# EAGLE design alpaca (EAGLE 9.6.2)
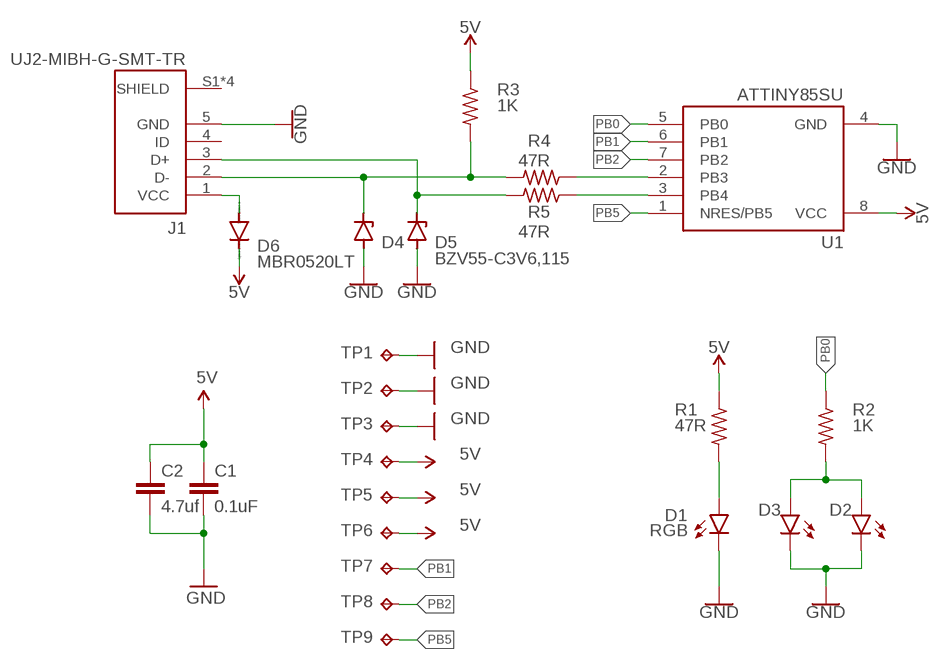
[diagram p0: schematic, sheet 1]

## Parts
C1  0.1uF  C-EUC0805K  [C0805K]
C2  4.7uf  C-EUC0805K  [C0805K]
D1  RGB  LED-3MM-NO_SILK  [LED_3MM-NS]
D2  LEDCHIPLED_1206  [CHIPLED_1206]
D3  LEDCHIPLED_1206  [CHIPLED_1206]
D4  BZV55-C3V6,115  ZENER-DIODESOD80C  [SOD80C]
D5  BZV55-C3V6,115  ZENER-DIODESOD80C  [SOD80C]
D6  MBR0520LT  [SOD123]
J1  UJ2-MIBH-G-SMT-TR  [CUI_UJ2-MIBH-G-SMT-TR]
R1  47R  R-US_R0603  [R0603]
R2  1K  R-US_R0603  [R0603]
R3  1K  R-US_R0603  [R0603]
R4  47R  R-US_R0603  [R0603]
R5  47R  R-US_R0603  [R0603]
TP1  TPTP13R  [TP13R]
TP2  TPTP13R  [TP13R]
TP3  TPTP13R  [TP13R]
TP4  TPTP13R  [TP13R]
TP5  TPTP13R  [TP13R]
TP6  TPTP13R  [TP13R]
TP7  TPTP13R  [TP13R]
TP8  TPTP13R  [TP13R]
TP9  TPTP13R  [TP13R]
U1  ATTINY85SU  [ATTINY85]

## Nets
5V: C1.1 C2.1 D6.C R1.1 R3.1 TP4.TP TP5.TP TP6.TP U1.8(VCC)
GND: C1.2 C2.2 D1.K(C) D2.C D3.C D4.A D5.A J1.5(GND) TP1.TP TP2.TP TP3.TP U1.4(GND)
N$1: D1.A R1.2
N$2: D4.C J1.2(D-) R3.2 R4.2
N$3: D5.C J1.3(D+) R5.2
N$5: D6.A J1.1(VCC)
N$6: R5.1 U1.3(PB4)
N$8: R4.1 U1.2(PB3)
N$9: D2.A D3.A R2.2
PB0: R2.1 U1.5(PB0)
PB1: TP7.TP U1.6(PB1)
PB2: TP8.TP U1.7(PB2)
PB5: TP9.TP U1.1(NRES/PB5)
Unconnected: J1.4(ID) J1.S1(SHIELD) J1.S2(SHIELD) J1.S3(SHIELD) J1.S4(SHIELD)

## Library data of the parts
C1 C2 = rcl:C-EU: CAPACITOR, European symbol; SPICEPREFIX: C
D1 = SparkFun-LED:LED: LED (Generic) Standard schematic elements and footprints for 5mm, 3mm, 1206, and 0603 sized LEDs. Generic LEDs with no color specified.
D2 D3 = led:LED: LED OSRAM: - CHIPLED LG R971, LG N971, LY N971, LG Q971, LY Q971, LO R971, LY R971 LH N974, LH R974 LS Q976, LO Q976, LY Q976 LO Q996 - Hyper CHIPLED LW Q18S LB Q993, LB Q99A, LB R99A - SideLED LS A670, LO A670, LY A670, LG A670, LP A670 LB A673, LV A673, LT A673, LW A673 LH A674 LY A675 LS A676, LA A676, LO A676, LY A676, LW A676 LS A679, LY A679, LG A679 - Hyper Micro SIDELED® LS Y876, LA Y876, LO Y876, LY Y876 LT Y87S - SmartLED LW L88C, LW L88S LB L89C, LB L89S, LG L890 LS L89K, LO L89K, LY L89K LS L896, LA L896, LO L896, LY L896 - TOPLED LS T670, LO T670, LY T670, LG T670, LP T670 LSG T670, LSP T670, LSY T670, LOP T670, LYG T670 LG T671, LOG T671, LSG T671 LB T673, LV T673, LT T673, LW T673 LH T674 LS T676, LA T676, LO T676, LY T676, LB T676, LH T676, LSB T676, LW T676 LB T67C, LV T67C, LT T67C, LS T67K, LO T67K, LY T67K, LW E67C LS E67B, LA E67B, LO E67B, LY E67B, LB E67C, LV E67C, LT E67C LW T67C LS T679, LY T679, LG T679 LS T770, LO T770, LY T770, LG T770, LP T770 LB T773, LV T773, LT T773, LW T773 LH T774 LS E675, LA E675, LY E675, LS T675 LS T776, LA T776, LO T776, LY T776, LB T776 LHGB T686 LT T68C, LB T68C - Hyper Mini TOPLED® LB M676 - Mini TOPLED Santana® LG M470 LS M47K, LO M47K, LY M47K Source: http://www.osram.convergy.de LUXEON: - LUMILED® LXK2-PW12-R00, LXK2-PW12-S00, LXK2-PW14-U00, LXK2-PW14-V00 LXK2-PM12-R00, LXK2-PM12-S00, LXK2-PM14-U00 LXK2-PE12-Q00, LXK2-PE12-R00, LXK2-PE12-S00, LXK2-PE14-T00, LXK2-PE14-U00 LXK2-PB12-K00, LXK2-PB12-L00, LXK2-PB12-M00, LXK2-PB14-N00, LXK2-PB14-P00, LXK2-PB14-Q00 LXK2-PR12-L00, LXK2-PR12-M00, LXK2-PR14-Q00, LXK2-PR14-R00 LXK2-PD12-Q00, LXK2-PD12-R00, LXK2-PD12-S00 LXK2-PH12-R00, LXK2-PH12-S00 LXK2-PL12-P00, LXK2-PL12-Q00, LXK2-PL12-R00 Source: www.luxeon.com KINGBRIGHT: KA-3528ASYC Source: www.kingbright.com
D4 D5 = diode:ZENER-DIODE: Z-Diode
D6 = diode:MBR0520LT: SCHOTTKY BARRIER RECTIFIER Source: http://onsemi.com .. MBR0520LT1-D.pdf
J1 = UJ2-MIBH-G-SMT-TR:UJ2-MIBH-G-SMT-TR: USB micro B type receptacle; MANUFACTURER: CUI; MAXIMUM_PACKAGE_HEIGHT: 2.95 mm; PARTREV: 1.0; STANDARD: Manufacturer Recommendations
R1-R5 = rcl:R-US_: RESISTOR, American symbol; SPICEPREFIX: R
TP1-TP9 = testpad:TP: Test pad
U1 = attiny85:ATTINY85: ATMEL ATtiny 85

## Board
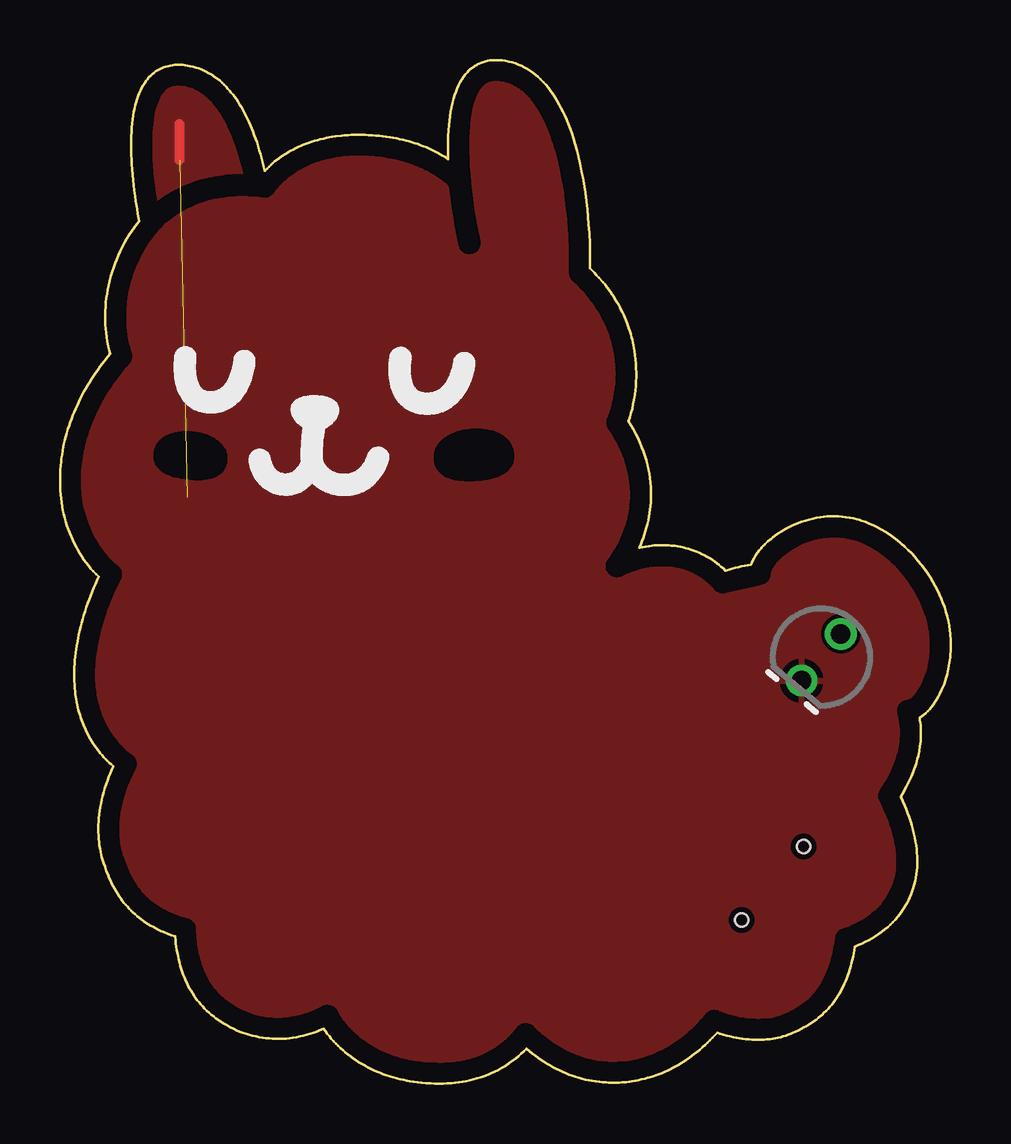
[diagram p1: board, top side]
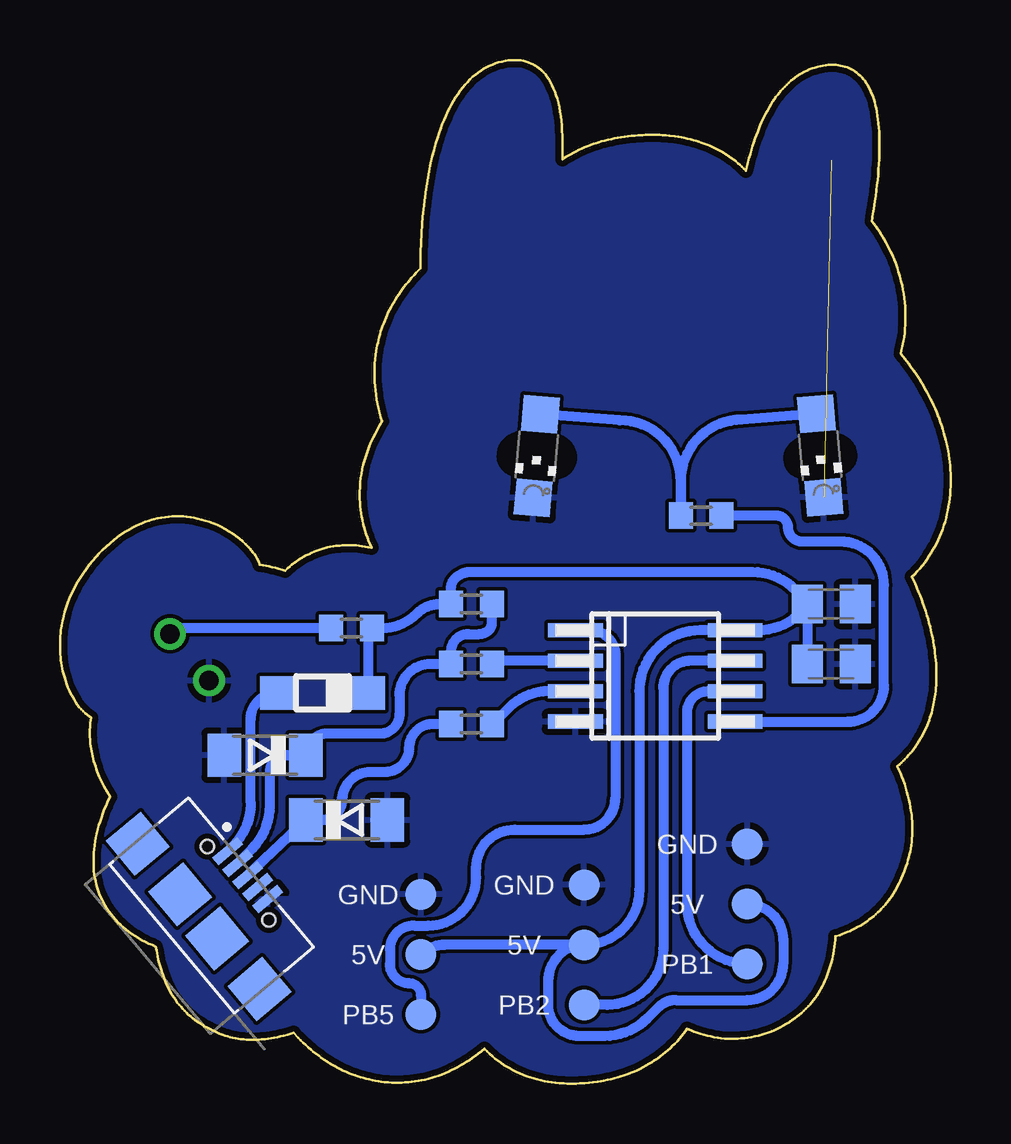
[diagram p2: board, bottom side, seen from below]

Size 37.14 x 42.65 mm. Coordinates in mm from the lower left corner, seen from the top.
Outline: 18.18,42.65 18.06,42.65 17.94,42.63 17.82,42.61 17.75,42.6 17.69,42.58 17.63,42.56 17.57,42.54 17.47,42.5 17.41,42.47 17.36,42.44 17.31,42.41 17.26,42.38 17.16,42.31 17.08,42.24 17.03,42.19 16.98,42.15 16.9,42.06 16.83,41.96 16.75,41.85 16.68,41.73 16.62,41.6 16.55,41.46 16.5,41.33 16.45,41.19 16.4,41.03 16.36,40.86 16.32,40.68 16.29,40.5 16.26,40.31 16.23,40.13 16.21,39.93 16.2,39.73 16.19,39.47 16.18,39.26 16.18,39 16.18,38.79 16.19,38.53 16.05,38.61 15.95,38.67 15.84,38.73 15.73,38.79 15.61,38.85 15.5,38.91 15.4,38.95 15.28,39.01 15.15,39.06 15.03,39.1 14.9,39.15 14.78,39.19 14.67,39.23 14.55,39.26 14.44,39.29 14.3,39.33 14.15,39.36 14.03,39.39 13.89,39.41 13.76,39.43 13.6,39.46 13.45,39.48 13.31,39.49 13.18,39.5 13.01,39.52 12.86,39.53 12.72,39.53 12.58,39.53 12.43,39.54 12.3,39.53 12.15,39.53 12.01,39.52 11.87,39.51 11.73,39.5 11.49,39.47 11.35,39.45 11.22,39.42 11.12,39.41 10.98,39.38 10.84,39.34 10.74,39.31 10.62,39.28 10.49,39.24 10.39,39.21 10.26,39.16 10.14,39.11 10.05,39.08 9.95,39.03 9.83,38.98 9.71,38.92 9.62,38.87 9.5,38.8 9.42,38.75 9.3,38.68 9.22,38.62 9.14,38.57 9.05,38.49 8.96,38.42 8.87,38.35 8.79,38.28 8.71,38.2 8.63,38.12 8.54,38.03 8.54,38.03 8.5,38.21 8.45,38.39 8.41,38.56 8.36,38.73 8.31,38.9 8.26,39.06 8.21,39.22 8.16,39.37 8.1,39.53 8.05,39.66 7.95,39.91 7.89,40.05 7.83,40.18 7.77,40.31 7.7,40.43 7.63,40.56 7.57,40.68 7.5,40.79 7.43,40.9 7.36,41.01 7.28,41.11 7.21,41.21 7.15,41.29 7.08,41.37 7,41.46 6.92,41.54 6.84,41.63 6.75,41.71 6.67,41.78 6.59,41.85 6.5,41.92 6.39,41.99 6.3,42.05 6.21,42.1 6.1,42.16 6,42.21 5.89,42.26 5.77,42.3 5.67,42.33 5.54,42.37 5.43,42.4 5.32,42.42 5.21,42.43 5.11,42.45 5,42.45 4.9,42.45 4.79,42.45 4.69,42.44 4.6,42.42 4.5,42.4 4.41,42.37 4.32,42.34 4.24,42.31 4.15,42.27 4.07,42.22 3.99,42.17 3.92,42.12 3.85,42.06 3.77,41.99 3.71,41.92 3.65,41.86 3.59,41.78 3.53,41.69 3.47,41.6 3.41,41.49 3.35,41.38 3.31,41.27 3.26,41.15 3.22,41.03 3.18,40.9 3.14,40.76 3.11,40.63 3.08,40.49 3.05,40.32 3.03,40.17 3.01,40.02 3,39.83 2.98,39.66 2.98,39.48 2.97,39.27 2.97,39.11 2.97,38.9 2.98,38.69 2.98,38.52 3,38.3 3.01,38.09 3.03,37.87 3.05,37.65 3.07,37.43 3.1,37.21 3.13,36.98 3.16,36.77 3.21,36.46 3.24,36.25 3.3,35.94 3.19,35.81 3.09,35.67 2.99,35.52 2.89,35.37 2.79,35.21 2.7,35.05 2.6,34.85 2.52,34.69 2.43,34.49 2.36,34.34 2.3,34.18 2.23,33.99 2.18,33.83 2.12,33.65 2.07,33.46 2.03,33.27 1.99,33.09 1.96,32.91 1.94,32.73 1.92,32.56 1.9,32.36 1.89,32.18 1.89,32 1.89,31.81 1.89,31.63 1.91,31.45 1.92,31.28 1.95,31.1 1.97,30.93 2.01,30.73 2.05,30.56 2.09,30.41 2.09,30.4 1.98,30.28 1.86,30.13 1.76,30 1.68,29.89 1.57,29.73 1.48,29.62 1.4,29.49 1.32,29.37 1.23,29.22 1.15,29.09 1.07,28.96 1,28.82 0.91,28.67 0.85,28.54 0.77,28.39 0.71,28.25 0.65,28.11 0.59,27.98 0.54,27.84 0.48,27.7 0.43,27.56 0.38,27.41 0.33,27.26 0.28,27.11 0.24,26.95 0.2,26.8 0.17,26.64 0.14,26.53 0.11,26.37 0.08,26.2 0.06,26.04 0.05,25.92 0.03,25.75 0.01,25.58 0.01,25.4 0,25.24 0,25.08 0,24.91 0.01,24.71 0.03,24.55 0.05,24.37 0.06,24.22 0.09,24.03 0.12,23.89 0.16,23.72 0.19,23.58 0.24,23.42 0.29,23.26 0.34,23.1 0.4,22.95 0.46,22.81 0.52,22.66 0.59,22.53 0.67,22.37 0.74,22.24 0.83,22.1 0.91,21.96 1,21.83 1.09,21.71 1.19,21.58 1.29,21.46 1.39,21.35 1.5,21.23 1.61,21.11 1.56,20.99 1.48,20.82 1.41,20.67 1.34,20.5 1.27,20.32 1.22,20.17 1.16,20.02 1.1,19.85 1.05,19.69 1,19.51 0.94,19.34 0.91,19.21 0.86,19.03 0.83,18.9 0.79,18.71 0.76,18.57 0.73,18.43 0.7,18.24 0.68,18.1 0.66,17.96 0.64,17.78 0.62,17.64 0.61,17.5 0.6,17.36 0.6,17.21 0.6,17.06 0.6,16.92 0.6,16.78 0.61,16.63 0.62,16.48 0.63,16.34 0.65,16.22 0.68,16.01 0.7,15.9 0.72,15.78 0.74,15.68 0.77,15.57 0.8,15.46 0.83,15.35 0.87,15.25 0.9,15.14 0.94,15.03 0.98,14.93 1.07,14.74 1.12,14.64 1.17,14.54 1.22,14.44 1.27,14.36 1.33,14.27 1.39,14.17 1.51,14 1.63,13.84 1.69,13.77 1.76,13.68 1.82,13.61 1.91,13.52 1.97,13.46 2.06,13.37 2.13,13.3 2.22,13.22 2.23,13.21 2.16,13.08 2.09,12.92 2.04,12.79 1.98,12.64 1.93,12.48 1.87,12.32 1.82,12.15 1.78,12 1.74,11.84 1.71,11.68 1.68,11.52 1.66,11.38 1.63,11.21 1.62,11.06 1.61,10.92 1.6,10.78 1.6,10.63 1.6,10.48 1.61,10.36 1.62,10.21 1.63,10.06 1.65,9.94 1.67,9.79 1.69,9.66 1.72,9.55 1.75,9.43 1.78,9.31 1.82,9.19 1.88,9.03 1.94,8.86 2,8.7 2.06,8.56 2.11,8.45 2.16,8.33 2.22,8.23 2.28,8.12 2.34,8.01 2.4,7.91 2.46,7.82 2.53,7.72 2.6,7.63 2.66,7.54 2.73,7.46 2.82,7.36 2.89,7.28 2.96,7.21 3.04,7.13 3.13,7.05 3.22,6.98 3.3,6.91 3.39,6.84 3.48,6.77 3.57,6.71 3.68,6.65 3.77,6.59 3.88,6.53 3.98,6.47 4.1,6.41 4.21,6.36 4.3,6.32 4.5,6.24 4.63,6.19 4.8,6.13 4.81,6.13 4.82,5.99 4.83,5.84 4.85,5.71 4.87,5.57 4.9,5.42 4.92,5.3 4.95,5.18 4.98,5.04 5.01,4.92 5.05,4.79 5.09,4.66 5.14,4.53 5.19,4.41 5.24,4.29 5.29,4.17 5.35,4.07 5.41,3.95 5.46,3.86 5.52,3.76 5.58,3.66 5.64,3.58 5.72,3.48 5.79,3.39 5.86,3.31 5.94,3.23 6.04,3.12 6.12,3.04 6.21,2.96 6.31,2.88 6.4,2.8 6.5,2.73 6.6,2.66 6.74,2.56 6.85,2.5 6.96,2.43 7.09,2.36 7.23,2.29 7.35,2.23 7.5,2.17 7.62,2.12 7.76,2.08 7.89,2.04 8.03,2 8.17,1.97 8.31,1.94 8.45,1.91 8.6,1.89 8.72,1.88 8.87,1.87 9,1.87 9.14,1.87 9.28,1.87 9.42,1.88 9.57,1.89 9.71,1.91 9.86,1.94 10,1.97 10.14,2 10.28,2.03 10.43,2.08 10.56,2.12 10.7,2.17 10.82,2.22 10.99,2.29 11,2.29 11.07,2.19 11.14,2.09 11.23,1.98 11.31,1.88 11.4,1.78 11.5,1.67 11.6,1.57 11.69,1.48 11.79,1.39 11.89,1.31 12,1.22 12.11,1.13 12.23,1.05 12.35,0.97 12.45,0.9 12.58,0.82 12.69,0.76 12.83,0.68 12.94,0.63 13.07,0.57 13.22,0.5 13.34,0.45 13.48,0.4 13.6,0.35 13.74,0.31 13.88,0.27 14.02,0.22 14.17,0.19 14.32,0.15 14.47,0.12 14.58,0.1 14.74,0.08 14.91,0.06 15.07,0.04 15.26,0.02 15.45,0.01 15.63,0 15.8,0 15.98,0 16.15,0.01 16.31,0.02 16.48,0.04 16.64,0.06 16.78,0.08 16.93,0.1 17.09,0.14 17.24,0.17 17.39,0.21 17.54,0.26 17.69,0.31 17.83,0.37 17.97,0.43 18.12,0.49 18.25,0.56 18.38,0.63 18.51,0.7 18.62,0.78 18.75,0.86 18.87,0.95 18.99,1.05 19.11,1.14 19.22,1.24 19.34,1.35 19.45,1.46 19.57,1.36 19.7,1.25 19.81,1.16 19.94,1.07 20.07,0.98 20.19,0.91 20.31,0.83 20.43,0.76 20.55,0.69 20.68,0.62 20.82,0.55 20.95,0.49 21.09,0.43 21.22,0.38 21.36,0.33 21.49,0.28 21.63,0.24 21.77,0.2 21.92,0.17 22.06,0.14 22.18,0.12 22.33,0.09 22.49,0.07 22.61,0.06 22.76,0.05 22.89,0.04 23.02,0.04 23.15,0.04 23.3,0.05 23.45,0.05 23.6,0.07 23.74,0.08 23.85,0.1 23.99,0.12 24.11,0.15 24.24,0.17 24.38,0.21 24.49,0.24 24.6,0.27 24.73,0.31 24.84,0.34 24.97,0.39 25.08,0.44 25.21,0.49 25.33,0.55 25.44,0.6 25.56,0.66 25.67,0.72 25.8,0.79 25.89,0.85 26.02,0.93 26.12,1 26.24,1.08 26.34,1.16 26.46,1.24 26.57,1.34 26.67,1.42 26.79,1.52 26.9,1.62 27,1.71 27.1,1.81 27.2,1.91 27.4,2.13 27.52,2.09 27.66,2.05 27.81,2 27.93,1.97 28.07,1.94 28.2,1.91 28.33,1.89 28.46,1.87 28.58,1.86 28.72,1.84 28.85,1.83 28.97,1.83 29.1,1.83 29.22,1.83 29.35,1.84 29.48,1.84 29.6,1.86 29.72,1.87 29.81,1.89 29.93,1.91 30.05,1.94 30.14,1.97 30.25,2 30.35,2.03 30.47,2.08 30.56,2.11 30.65,2.16 30.79,2.22 30.9,2.28 31.02,2.34 31.12,2.4 31.23,2.47 31.34,2.53 31.43,2.6 31.53,2.67 31.62,2.74 31.69,2.8 31.78,2.88 31.85,2.95 31.94,3.03 32.03,3.12 32.09,3.2 32.18,3.29 32.24,3.38 32.32,3.49 32.38,3.57 32.44,3.66 32.49,3.75 32.55,3.85 32.6,3.95 32.65,4.06 32.71,4.17 32.75,4.28 32.8,4.39 32.84,4.51 32.88,4.63 32.93,4.76 32.96,4.89 33,5.02 33.03,5.16 33.07,5.31 33.09,5.43 33.11,5.56 33.14,5.71 33.3,5.78 33.43,5.84 33.57,5.9 33.72,5.98 33.86,6.06 33.99,6.14 34.12,6.23 34.26,6.33 34.39,6.43 34.5,6.53 34.61,6.62 34.72,6.73 34.82,6.84 34.92,6.95 35.01,7.06 35.09,7.18 35.18,7.3 35.24,7.41 35.32,7.54 35.38,7.66 35.43,7.77 35.49,7.91 35.53,8.03 35.58,8.17 35.62,8.31 35.65,8.45 35.68,8.58 35.7,8.72 35.72,8.87 35.73,9.01 35.74,9.16 35.74,9.32 35.74,9.45 35.73,9.61 35.71,9.78 35.69,9.94 35.67,10.1 35.64,10.25 35.6,10.42 35.56,10.6 35.51,10.76 35.46,10.92 35.4,11.1 35.35,11.25 35.28,11.43 35.22,11.59 35.14,11.77 35.05,11.96 35.17,12.16 35.23,12.26 35.29,12.37 35.39,12.57 35.45,12.7 35.49,12.79 35.57,13 35.62,13.12 35.66,13.22 35.69,13.33 35.72,13.44 35.75,13.53 35.78,13.64 35.8,13.74 35.82,13.86 35.85,14.05 35.87,14.16 35.88,14.26 35.88,14.36 35.89,14.45 35.89,14.55 35.89,14.65 35.89,14.75 35.88,14.84 35.88,14.95 35.87,15.05 35.85,15.15 35.84,15.25 35.84,15.25 35.93,15.31 36,15.37 36.09,15.44 36.17,15.51 36.25,15.6 36.32,15.69 36.41,15.79 36.48,15.89 36.55,16.01 36.61,16.12 36.68,16.25 36.75,16.39 36.8,16.52 36.86,16.65 36.9,16.79 36.95,16.93 36.99,17.07 37.01,17.18 37.04,17.29 37.06,17.41 37.08,17.53 37.1,17.65 37.11,17.77 37.12,17.89 37.13,18.02 37.13,18.15 37.14,18.27 37.13,18.4 37.13,18.53 37.12,18.66 37.11,18.76 37.09,18.88 37.07,19.07 37.04,19.19 37.03,19.28 36.98,19.47 36.93,19.66 36.88,19.84 36.81,20.03 36.74,20.21 36.66,20.4 36.57,20.59 36.49,20.73 36.39,20.92 36.27,21.1 36.15,21.29 36.05,21.44 35.91,21.62 35.77,21.8 35.63,21.96 35.5,22.09 35.37,22.23 35.21,22.38 35.05,22.52 34.9,22.64 34.74,22.77 34.58,22.88 34.41,23 34.26,23.08 34.18,23.13 34.07,23.19 33.91,23.27 33.75,23.34 33.58,23.4 33.41,23.46 33.31,23.49 33.23,23.52 33.07,23.55 32.92,23.58 32.75,23.61 32.61,23.63 32.45,23.64 32.3,23.64 32.15,23.64 32,23.63 31.85,23.62 31.7,23.6 31.53,23.57 31.39,23.54 31.22,23.5 31.08,23.46 30.91,23.4 30.76,23.35 30.59,23.28 30.42,23.2 30.26,23.12 30.1,23.02 29.95,22.93 29.8,22.83 29.73,22.77 29.65,22.71 29.52,22.6 29.39,22.48 29.33,22.42 29.27,22.35 29.21,22.29 29.16,22.23 29.07,22.12 29.03,22.05 28.99,21.99 28.92,21.88 28.86,21.76 28.84,21.7 28.81,21.62 28.8,21.62 28.67,21.6 28.55,21.58 28.42,21.55 28.28,21.52 28.15,21.49 28.02,21.46 27.88,21.42 27.75,21.37 27.74,21.38 27.65,21.47 27.56,21.54 27.47,21.62 27.39,21.68 27.29,21.75 27.19,21.82 27.09,21.88 26.98,21.95 26.86,22.01 26.76,22.07 26.65,22.11 26.54,22.16 26.43,22.21 26.31,22.25 26.2,22.28 26.09,22.31 25.97,22.34 25.87,22.37 25.73,22.39 25.63,22.41 25.49,22.42 25.38,22.43 25.26,22.44 25.15,22.44 25.03,22.44 24.92,22.44 24.79,22.43 24.67,22.42 24.54,22.4 24.42,22.38 24.29,22.36 24.15,22.33 24.21,22.47 24.27,22.61 24.32,22.74 24.37,22.88 24.42,23.03 24.46,23.18 24.49,23.32 24.53,23.47 24.56,23.63 24.58,23.77 24.6,23.91 24.62,24.06 24.63,24.21 24.64,24.37 24.64,24.52 24.64,24.66 24.63,24.86 24.62,25.03 24.59,25.24 24.57,25.42 24.53,25.6 24.49,25.78 24.44,25.97 24.38,26.16 24.32,26.35 24.25,26.54 24.18,26.71 24.09,26.9 24.01,27.06 23.9,27.26 23.8,27.43 23.71,27.59 23.76,27.77 23.81,27.95 23.86,28.13 23.9,28.31 23.93,28.5 23.96,28.71 23.98,28.88 24,29.06 24.01,29.25 24.02,29.45 24.02,29.63 24.02,29.81 24.01,29.99 23.99,30.18 23.97,30.36 23.95,30.53 23.93,30.64 23.91,30.76 23.88,30.88 23.86,30.99 23.83,31.11 23.8,31.23 23.76,31.34 23.72,31.46 23.68,31.58 23.63,31.7 23.59,31.81 23.55,31.92 23.5,32.02 23.45,32.13 23.39,32.25 23.34,32.35 23.27,32.47 23.22,32.56 23.14,32.69 23.08,32.78 23,32.9 22.94,32.99 22.8,33.18 22.71,33.3 22.63,33.39 22.48,33.58 22.37,33.69 22.28,33.79 22.1,33.97 22.1,34.34 22.1,34.66 22.08,35.02 22.06,35.43 22.04,35.8 22.01,36.12 21.98,36.44 21.94,36.78 21.9,37.12 21.86,37.39 21.8,37.74 21.75,38.01 21.68,38.36 21.61,38.63 21.55,38.9 21.47,39.17 21.41,39.38 21.34,39.6 21.27,39.77 21.2,39.97 21.13,40.15 21.05,40.33 20.97,40.5 20.89,40.65 20.81,40.8 20.73,40.95 20.64,41.1 20.55,41.23 20.45,41.37 20.36,41.49 20.25,41.62 20.15,41.73 20.04,41.85 19.93,41.95 19.82,42.04 19.71,42.12 19.59,42.21 19.47,42.28 19.35,42.35 19.23,42.41 19.11,42.46 18.98,42.51 18.85,42.55 18.71,42.59 18.57,42.62 18.43,42.64 18.31,42.65 18.18,42.65
Copper layers (1*16): Top 0.035mm / dielectric 1.5mm / Bottom 0.035mm
Design rules "default *": minimum track width 6mil, minimum drill 0.35mm, track to track 6mil, track to pad 6mil, pad to pad 6mil, via to via 6mil, smd to smd 6mil, copper to edge 10mil, drill to drill 6mil, minimum pad ring 10mil, minimum via ring 8mil, stop-mask expansion 4mil, vias tented up to drill 0mil, thermal gap 10mil
tRestrict: area 15.6,25.1 to 18.9,27.2; area 3.9,25.2 to 6.9,27.1; area 0,0 to 37.1,42.7
bRestrict: area 15.6,25.1 to 18.9,27.2; area 3.9,25.2 to 6.9,27.1

### Footprints (pad centres in the part's own frame; a part is rotated, then mirrored left to right if it is on the bottom)
C0805K = smd 1.3 x 1.6: 1 -1,0; 2 1,0
LED_3MM-NS = drill 0.813: A -1.27,0; K 1.27,0
CHIPLED_1206 = smd 1.5 x 1.5: A 0,-1.75; C 0,1.75
SOD80C = smd 1.4 x 1.8: A 1.7,0; C -1.7,0
SOD123 = smd 1.4 x 1.4: A 1.9,0; C -1.9,0
CUI_UJ2-MIBH-G-SMT-TR = smd 0.4 x 1.35: 1 -1.3,2.675; 2 -0.65,2.675; 3 0,2.675; 4 0.65,2.675; 5 1.3,2.675 | smd 1.9 x 1.9: S1 -3.95,0; S2 -1.2,0; S3 1.2,0; S4 3.95,0 | hole 0.55: -2,2.15; 2,2.15
R0603 = smd 1 x 1.1: 1 -0.85,0; 2 0.85,0
TP13R = smd 1.3 x 1.3: TP 0,0
ATTINY85 = smd 0.6 x 2.286: 1 -1.905,-3.33; 2 -0.635,-3.33; 3 0.635,-3.33; 4 1.905,-3.33; 5 1.905,3.33; 6 0.635,3.33; 7 -0.635,3.33; 8 -1.905,3.33

### Placement (x,y rotation side)
C1  4.98,19.98 0 bottom
C2  4.98,17.48 0 bottom
D1  31.73,17.76 230 top
D2  5.44,26.17 185 bottom
D3  17.26,26.15 175 bottom
D4  28.58,13.68 180 bottom
D5  25.18,10.98 0 bottom
D6  26.18,16.28 180 bottom
J1  31.35,6.97 310 bottom
R1  24.98,18.98 180 bottom
R2  10.4,23.66 180 bottom
R3  19.98,19.98 0 bottom
R4  19.98,17.48 180 bottom
R5  19.98,14.98 180 bottom
TP1  22.08,7.88 0 bottom
TP2  8.48,9.98 0 bottom
TP3  15.28,8.28 0 bottom
TP4  22.08,5.38 0 bottom
TP5  15.28,5.78 0 bottom
TP6  8.48,7.48 0 bottom
TP7  8.48,4.98 0 bottom
TP8  15.28,3.28 0 bottom
TP9  22.08,2.88 0 bottom
U1  12.32,16.99 270 bottom

### Tracks (layer width: path | path; a pad name or v marks a point on that pad's centre or on a via)
5V
  Bottom 0.406: C1.1 6.48,20.58 arc-45 8.28,21.32 20,21.32 arc-45 20.67,21.04 arc-45 20.83,20.66 R3.1 21.3,19.98 arc-45 22.26,19.58 arc45 23.71,18.98 R1.1 24.28,18.83 D6.C | C1.1 C2.1 | C1.1 6.23,19.64 arc45 8.03,18.89 U1.8 10.44,18.89 arc-90 12.98,16.35 12.98,8.08 arc90 TP5.TP | TP5.TP arc-90 16.78,4.28 16.78,3.28 arc-90 15.48,1.98 14.43,1.98 arc-45 12.64,2.73 12.18,3.18 arc45 11.46,3.48 8.48,3.48 arc-90 6.98,4.98 6.98,5.98 arc-90 TP6.TP | TP5.TP 21.12,5.78 arc-45 TP4.TP
GND  (1 unrouted)
  Top 0.406: 4.98,38.48 4.98,39.98
  pour Top (rank 3): -0.02,-0.02 36.81,-0.02 36.81,43.16 -0.02,43.16
  pour Bottom (rank 3): -0.02,-0.02 36.81,-0.02 36.81,43.16 -0.02,43.16
N$1
  Bottom 0.406: R1.2 31.95,18.98 arc-45 D1.A
N$2
  Bottom 0.152: 20.83,18 R4.2
  Bottom 0.406: 20.83,18 arc45 20.62,18.53 arc45 20.12,18.73 19.65,18.73 arc-45 19.25,18.9 arc-45 19.13,19.18 R3.2 | J1.2 29.13,9.78 arc-45 28.38,11.58 28.38,12.98 arc90 27.68,13.68 D4.C arc90 25.98,14.58 23.78,14.58 arc-90 22.98,15.38 22.98,16.18 arc90 21.68,17.48 R4.2
N$3
  Bottom 0.406: R5.2 21.58,14.98 arc-90 22.58,13.98 arc90 23.58,12.98 24.18,12.98 arc-90 25.38,11.78 arc90 26.18,10.98 D5.C J1.3
N$5
  Bottom 0.406: J1.1 29.93,9.9 arc-45 29.18,11.69 29.18,15.18 arc90 D6.A
N$6
  Bottom 0.406: U1.3 16.78,16.35 arc-45 18.39,15.68 19.07,15.01 arc45 R5.1
N$8
  Bottom 0.406: U1.2 18.8,17.62 arc-45 R4.1
N$9
  Bottom 0.406: D2.A 8.71,27.66 arc-90 11.25,25.12 R2.2 11.25,25.1 arc-90 13.79,27.64 D3.A
PB0
  Bottom 0.406: U1.5 4.29,15.08 arc-90 2.78,16.58 2.78,20.78 arc-90 4.58,22.58 6.18,22.58 arc90 6.78,23.18 arc-90 7.26,23.66 R2.1
PB1
  Bottom 0.406: U1.6 10.12,16.35 arc-90 10.98,15.48 10.98,7.48 arc-90 TP7.TP
PB2
  Bottom 0.406: U1.7 10.85,17.62 arc-90 11.98,16.48 11.98,5.62 arc90 14.32,3.28 TP8.TP
PB5
  Bottom 0.406: U1.1 15.02,18.89 arc90 13.98,17.85 13.98,11.88 arc90 15.28,10.58 18.18,10.58 arc-90 19.78,8.98 19.78,8.58 arc90 21.78,6.58 22.38,6.58 arc-90 23.38,5.58 23.38,4.98 arc-90 22.58,4.18 arc90 22.08,3.68 TP9.TP

### Text on the board
bPlace: GND | 5V | GND | GND | 5V | PB1 | 5V | PB2 | PB5